# Altium schematic sheet lichten.SchDoc
size A4; SheetNumber: 1; SheetTotal: 1
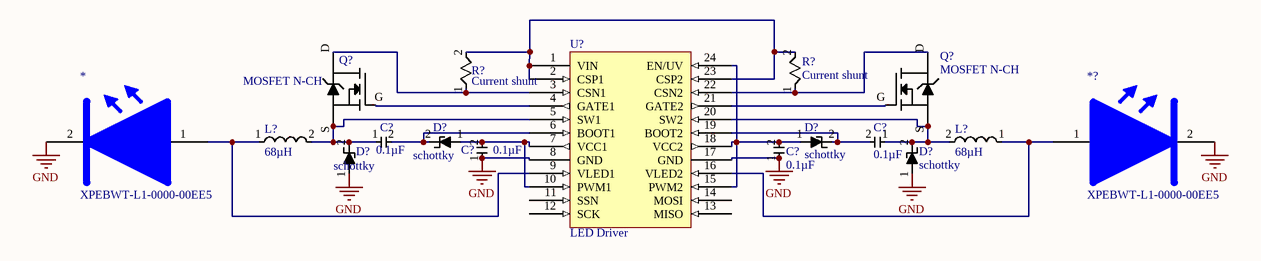
[diagram p0: lichten.SchDoc]

## Parts
(Parts that share a designator on the sheet are numbered #1, #2 ... from top to bottom, then left to right.)
*  XPEBWT-L1-0000-00EE5
*?  XPEBWT-L1-0000-00EE5
C?#1  0.1µF
C?#2  0.1µF
C?#3  0.1µF
C?#4  0.1µF
D?#1  schottky
D?#2  schottky
D?#3  schottky
D?#4  schottky
L?#1  68µH
L?#2  68µH
Q?#1  MOSFET N-CH
Q?#2  MOSFET N-CH
R?#1  Current shunt
R?#2  Current shunt
U?  LED Driver

## Nets
GND: *.2 *?.2 C?#2.1 C?#3.1 D?#3.1 D?#4.1 U?.8(GND) U?.17(GND)
Net*?_1: *?.1 L?#2.1 U?.16(VLED2)
Net*_1: *.1 L?#1.1 U?.9(VLED1)
NetC?#1_1: C?#1.1 D?#3.2 L?#1.2 Q?#1.S U?.5(SW1)
NetC?#1_2: C?#1.2 D?#1.2 U?.6(BOOT1)
NetC?#2_2: C?#2.2 D?#1.1 U?.7(VCC1) U?.10(PWM1)
NetC?#3_2: C?#3.2 D?#2.1 U?.15(PWM2) U?.18(VCC2) U?.24(EN/UV)
NetC?#4_1: C?#4.1 D?#4.2 L?#2.2 Q?#2.S U?.20(SW2)
NetC?#4_2: C?#4.2 D?#2.2 U?.19(BOOT2)
NetQ?#1_D: Q?#1.D R?#1.1 U?.3(CSN1)
NetQ?#1_G: Q?#1.G U?.4(GATE1)
NetQ?#2_D: Q?#2.D R?#2.1 U?.22(CSN2)
NetQ?#2_G: Q?#2.G U?.21(GATE2)
NetR?#1_2: R?#1.2 R?#2.2 U?.1(VIN) U?.2(CSP1) U?.23(CSP2)

Not connected (* = marked no-connect by the designer): U? 11(SSN) 12(SCK) 13(MISO) 14(MOSI)

## Library data of the parts
* *? = XPEBWT-L1-0000-00EE5: LED, XLAMP, XP-E, NEUTRAL WHITE, 114LM; Manufacturer: Cree; Lens Color: Clear; Viewing Angle: 110°; Forward Current: 350mA; Forward Voltage: 2.9V; Correlated Color Temperature (CCT): 4000K; Max Current Rating: 1A; Thermal Resistance of Package: 9°C/W; Color Rendering Index (CRI): 75; Lens Style: Square; Number of Elements: 1; Max Power Dissipation: 3W; Supplier 1: Farnell; Manufacturer Part Number: XPEBWT-L1-0000-00EE5; RoHS: Yes; Category: LEDs; Stock 1: 979; Pricing 1: 1=0,98400, 10=0,93000, 25=0,90700, 50=0,87600, 100=0,84500, 250=0,76600, 500=0,75600 (GBP); Mount: Surface Mount; Case/Package: SMD/SMT; Number of Pins: 2; Color: White; Max Operating Temperature: 85°C; Package Quantity: 1000; Packaging: Tape and Reel; Illumination Color: White; Test Current: 350mA; Luminous Flux: 114lm; Number of LEDs: 1; Series: Xlamp XP-E2; Length: 3.45mm; Width: 3.45mm; Height: 2.36mm; Depth: 3.45mm; Radiation Hardening: No; REACH SVHC: Unknown; Lead Free: Lead Free; RoHS Compliant: Yes; ComponentLink1URL: https://datasheet.ciiva.com/6348/xlampxpbl-6348581.pdf?src-supplier=Digi-Key; ComponentLink1Description: https://datasheet.ciiva.com/6348/xlampxpbl-6348581.pdf?src-supplier=Digi-Key; ComponentLink2URL: https://datasheet.ciiva.com/8073/xlampxpe-8073289.pdf?src-supplier=Element14; ComponentLink2Description: https://datasheet.ciiva.com/8073/xlampxpe-8073289.pdf?src-supplier=Element14; ComponentLink3URL: https://datasheet.ciiva.com/6348/xlampxpbl-6348587.pdf?src-supplier=Digi-Key; ComponentLink3Description: https://datasheet.ciiva.com/6348/xlampxpbl-6348587.pdf?src-supplier=Digi-Key; ComponentLink4URL: https://datasheet.ciiva.com/22791/xlampxpe-22791615.pdf?src-supplier=Farnell; ComponentLink4Description: https://datasheet.ciiva.com/22791/xlampxpe-22791615.pdf?src-supplier=Farnell; Supplier Part Number 1: 2216685
C?#1-C?#4 = C0805C104K5RACTU: Cap Ceramic 0.1uF 50V X7R 10% SMD 2.0 x 1.2 mm 125 C Paper T/R; Manufacturer: KEMET; Capacitance: 100nF; Voltage: 500V; Supplier 1: Farnell; Manufacturer Part Number: C0805C104K5RACTU; RoHS: Yes; Category: Ceramic Capacitors; Stock 1: 148517; Pricing 1: 10=0,07810, 100=0,05810, 500=0,03910, 1000=0,03450, 2000=0,03090 (GBP); Mount: Surface Mount,PCB; Case/Package: 0805; Number of Pins: 2; Case Code (Imperial): 0805; Case Code (Metric): 2012; Contact Plating: Tin,Matte; Dielectric Material: Ceramic; Min Operating Temperature: -55°C; Max Operating Temperature: 125°C; Tolerance: 10%; Dielectric: X7R; Package Quantity: 4000; Voltage Rating: 50V; Packaging: Tape and Reel; Voltage Rating (DC): 50V; Termination: SMD/SMT; Series: C0805C; Construction: Flat; Length: 2mm; Width: 1.2mm; Height: 0.9mm; Depth: 1.25mm; Lead Pitch: 0.75mm; Thickness: 0.035inch; Radiation Hardening: No; RoHS Compliant: Yes; REACH SVHC: No SVHC; ComponentLink1URL: https://datasheet.ciiva.com/14589/70095383-14589048.pdf?src-supplier=Allied+Electronics; ComponentLink1Description: https://datasheet.ciiva.com/14589/70095383-14589048.pdf?src-supplier=Allied+Electronics; ComponentLink2URL: https://datasheet.ciiva.com/28682/1851736-28682232.pdf?src-supplier=Element14; ComponentLink2Description: https://datasheet.ciiva.com/28682/1851736-28682232.pdf?src-supplier=Element14; ComponentLink3URL: https://datasheet.ciiva.com/32431/slceramic-chip-condensers-e-32431755.pdf?src-supplier=Distrelec; ComponentLink3Description: https://datasheet.ciiva.com/32431/slceramic-chip-condensers-e-32431755.pdf?src-supplier=Distrelec; ComponentLink4URL: https://datasheet.ciiva.com/18410/70095383-18410815.pdf?src-supplier=Allied+Electronics; ComponentLink4Description: https://datasheet.ciiva.com/18410/70095383-18410815.pdf?src-supplier=Allied+Electronics; Supplier Part Number 1: 1414664
D?#1-D?#4 = PMEG3050EP,115: NEXPERIA - PMEG3050EP,115 - Schottky-likriktare, 30 V, 5 A, Enkel, SOD-128, 2 Stift, 360 mV; Manufacturer: Nexperia USA; Supplier 1: Farnell; Manufacturer Part Number: PMEG3050EP,115; RoHS: No; Stock 1: 110544; Pricing 1: 5=0,38500, 10=0,33600, 100=0,21500, 500=0,14100, 1000=0,10700, 5000=0,10300 (GBP); ComponentLink1URL: http://www.farnell.com/datasheets/609324.pdf?src-supplier=Farnell; ComponentLink1Description: http://www.farnell.com/datasheets/609324.pdf?src-supplier=Farnell; ComponentLink2URL: https://assets.nexperia.com/documents/data-sheet/PMEG3050EP.pdf?src-supplier=Digi-Key; ComponentLink2Description: https://assets.nexperia.com/documents/data-sheet/PMEG3050EP.pdf?src-supplier=Digi-Key; Supplier Part Number 1: 1829197
L?#1 L?#2 = SRR1210-680M: BOURNS         SRR1210-680M.             INDUCTOR, SHIELDED, 68UH, 2.7A, SMD; Core Material: Ferrite; Tolerance: 20%; DC Resistance (DCR): 102mR; Q Factor: 12; Max DC Current: 3A; Self Resonant Frequency: 3.8MHz; Test Frequency: 100kHz; Supplier 1: Farnell; Manufacturer: Bourns; Manufacturer Part Number: SRR1210-680M; RoHS: Yes; Category: Fixed Inductors; Stock 1: 3; Pricing 1: 1=0,82800, 10=0,75600, 25=0,68400, 50=0,57100, 100=0,53600, 250=0,46600, 1250=0,43300 (GBP); Mount: Surface Mount; Case/Package: 1210; Min Operating Temperature: -40°C; Max Operating Temperature: 125°C; Inductance: 68uH; Packaging: Tape and Reel; Shielding: Shielded; Saturation Current: 2.7A; Package Quantity: 250; Current Rating: 3A; Resistor Type: Wirewound; Termination: SMD/SMT; DC Current: 3A; Series: SRR1210; Inductance Tolerance: 20%; RMS Current (Irms): 3A; Length: 12mm; Width: 0.472inch; Height: 10mm; Height - Seated (Max): 0.394inch; Depth: 12.5mm; Military Standard: Not; RoHS Compliant: Yes; REACH SVHC: No SVHC; ComponentLink1URL: https://datasheet.ciiva.com/11799/0900766b80f2b72a-11799858.pdf?src-supplier=RSComponents; ComponentLink1Description: https://datasheet.ciiva.com/11799/0900766b80f2b72a-11799858.pdf?src-supplier=RSComponents; ComponentLink2URL: https://datasheet.ciiva.com/48684/srr1210-48684857.pdf?src-supplier=Avnet; ComponentLink2Description: https://datasheet.ciiva.com/48684/srr1210-48684857.pdf?src-supplier=Avnet; ComponentLink3URL: https://datasheet.ciiva.com/17285/srr1210-17285962.pdf?src-supplier=Avnet+Europe; ComponentLink3Description: https://datasheet.ciiva.com/17285/srr1210-17285962.pdf?src-supplier=Avnet+Europe; ComponentLink4URL: https://datasheet.ciiva.com/6697/srr1210-6697611.pdf?src-supplier=Digi-Key; ComponentLink4Description: https://datasheet.ciiva.com/6697/srr1210-6697611.pdf?src-supplier=Digi-Key; ComponentLink5URL: https://datasheet.ciiva.com/46437/1430851-46437356.pdf?src-supplier=Element14; ComponentLink5Description: https://datasheet.ciiva.com/46437/1430851-46437356.pdf?src-supplier=Element14; ComponentLink6URL: https://datasheet.ciiva.com/6697/srr1210-6697613.pdf?src-supplier=Digi-Key; ComponentLink6Description: https://datasheet.ciiva.com/6697/srr1210-6697613.pdf?src-supplier=Digi-Key; ComponentLink7URL: https://datasheet.ciiva.com/46437/1430851-46437357.pdf?src-supplier=Element14; ComponentLink7Description: https://datasheet.ciiva.com/46437/1430851-46437357.pdf?src-supplier=Element14; ComponentLink8URL: https://datasheet.ciiva.com/6697/srr1210-6697615.pdf?src-supplier=Digi-Key; ComponentLink8Description: https://datasheet.ciiva.com/6697/srr1210-6697615.pdf?src-supplier=Digi-Key; Supplier Part Number 1: 2434810
Q?#1 Q?#2 = IRLR024NTRPBF: Trans MOSFET N-CH 55V 17A 3-Pin(2+Tab) DPAK T/R; Manufacturer: International Rectifier; Rise Time: 74ns; Gate to Source Voltage (Vgs): 16V; Fall Time: 29ns; Power Dissipation: 45W; Drain to Source Resistance: 110mR; Turn-Off Delay Time: 20ns; Turn-On Delay Time: 7.1ns; Rds On Max: 65mR; Input Capacitance: 480pF; Number of Elements: 1; Element Configuration: Single; Nominal Vgs: 2V; On-State Resistance: 80mR; Supplier 1: Farnell; Manufacturer Part Number: IRLR024NTRPBF; RoHS: Yes; Category: MOSFETs; Stock 1: 4226; Pricing 1: 1=0,84600, 10=0,61400, 100=0,43100, 500=0,37300, 1000=0,28400 (GBP); Mount: Surface Mount; Case/Package: DPAK; Number of Pins: 3; Min Operating Temperature: -55°C; Max Operating Temperature: 175°C; Continuous Drain Current (ID): 17A; Drain to Source Breakdown Voltage: 55V; Package Quantity: 1; Packaging: Tape and Reel; Max Power Dissipation: 45W; Drain to Source Voltage (Vdss): 55V; Voltage Rating (DC): 55V; Current Rating: 17A; Series: HEXFET®; Drain-source On Resistance-Max: 80mR; Length: 6.73mm; Width: 6.22mm; Height: 2.39mm; Radiation Hardening: No; RoHS Compliant: Yes; Lead Free: Lead Free; REACH SVHC: No SVHC; ComponentLink1URL: https://datasheet.ciiva.com/34303/2029683-34303947.pdf?src-supplier=Jameco; ComponentLink1Description: https://datasheet.ciiva.com/34303/2029683-34303947.pdf?src-supplier=Jameco; ComponentLink2URL: https://datasheet.ciiva.com/7835/irlr024npbf-7835786.pdf?src-supplier=Element14; ComponentLink2Description: https://datasheet.ciiva.com/7835/irlr024npbf-7835786.pdf?src-supplier=Element14; ComponentLink3URL: https://datasheet.ciiva.com/937/irlr024npbf-937362.pdf?src-supplier=Digi-Key; ComponentLink3Description: https://datasheet.ciiva.com/937/irlr024npbf-937362.pdf?src-supplier=Digi-Key; ComponentLink4URL: https://datasheet.ciiva.com/937/irlr024npbf-937363.pdf?src-supplier=Digi-Key; ComponentLink4Description: https://datasheet.ciiva.com/937/irlr024npbf-937363.pdf?src-supplier=Digi-Key; ComponentLink5URL: https://datasheet.ciiva.com/937/irlr024npbf-937361.pdf?src-supplier=Digi-Key; ComponentLink5Description: https://datasheet.ciiva.com/937/irlr024npbf-937361.pdf?src-supplier=Digi-Key; ComponentLink6URL: https://datasheet.ciiva.com/16364/irlr024npbf-16364248.pdf?src-supplier=Future+Electronics; ComponentLink6Description: https://datasheet.ciiva.com/16364/irlr024npbf-16364248.pdf?src-supplier=Future+Electronics; Supplier Part Number 1: 2468052
R?#1 R?#2 = ERJ-1TRQFR22U: Res Thick Film 2512 0.22 Ohm 1% 1W 200ppm/C Molded SMD SMD Embossed Carrier T/R; Manufacturer: Panasonic; Resistance: 220mR; Temperature Coefficient: 200ppm/°C; Supplier 1: Farnell; Manufacturer Part Number: ERJ-1TRQFR22U; RoHS: Yes; Category: Chip SMD Resistors; Stock 1: 2340; Pricing 1: 10=0,33700, 100=0,23200, 500=0,18800, 1000=0,15200, 2000=0,14200, 4000=0,13200, 20000=0,13100 (GBP); Mount: Surface Mount; Case/Package: 2512; Number of Pins: 2; Contact Plating: Tin; Case Code (Imperial): 2512; Case Code (Metric): 6432; Weight: 0.001429oz; Size Code: 2512; Min Operating Temperature: -55°C; Max Operating Temperature: 125°C; Power Rating: 1W; Tolerance: 1%; Resistor Type: Thick Film,Low-Ohm-Resistor; Packaging: Tape and Reel; Package Quantity: 1; Termination: SMD/SMT; Number of Terminations: 2; Max Power Dissipation: 1W; Features: Automotive AEC-Q200; Technology: THICK FILM; Series: ERJ; Resistance Tolerance: 1%; Construction: Rectangular; Length: 6.4mm; Width: 3.2mm; Height: 0.6mm; Depth: 3.2mm; Radiation Hardening: No; REACH SVHC: No SVHC; Military Standard: Not; RoHS Compliant: Yes; ComponentLink1URL: https://datasheet.ciiva.com/11810/0900766b80eefa12-11810196.pdf?src-supplier=RSComponents; ComponentLink1Description: https://datasheet.ciiva.com/11810/0900766b80eefa12-11810196.pdf?src-supplier=RSComponents; ComponentLink2URL: https://datasheet.ciiva.com/48537/erj-eng-tds-48537781.pdf?src-supplier=Distrelec; ComponentLink2Description: https://datasheet.ciiva.com/48537/erj-eng-tds-48537781.pdf?src-supplier=Distrelec; ComponentLink3URL: https://datasheet.ciiva.com/30080/6aoa0000ce3-30080535.pdf?src-supplier=Onlinecomponents.com; ComponentLink3Description: https://datasheet.ciiva.com/30080/6aoa0000ce3-30080535.pdf?src-supplier=Onlinecomponents.com; ComponentLink4URL: https://datasheet.ciiva.com/17206/aoa0000ce3-17206874.pdf?src-supplier=Avnet+Europe; ComponentLink4Description: https://datasheet.ciiva.com/17206/aoa0000ce3-17206874.pdf?src-supplier=Avnet+Europe; ComponentLink5URL: https://datasheet.ciiva.com/43455/391509-43455978.pdf?src-supplier=Farnell; ComponentLink5Description: https://datasheet.ciiva.com/43455/391509-43455978.pdf?src-supplier=Farnell; ComponentLink6URL: https://datasheet.ciiva.com/24165/aoa0000ce3-72189-24165531.pdf?src-supplier=Mouser; ComponentLink6Description: https://datasheet.ciiva.com/24165/aoa0000ce3-72189-24165531.pdf?src-supplier=Mouser; ComponentLink7URL: https://datasheet.ciiva.com/16760/70068852-16760588.pdf?src-supplier=Allied+Electronics; ComponentLink7Description: https://datasheet.ciiva.com/16760/70068852-16760588.pdf?src-supplier=Allied+Electronics; ComponentLink8URL: https://datasheet.ciiva.com/6064/391509-6064542.pdf?src-supplier=Farnell; ComponentLink8Description: https://datasheet.ciiva.com/6064/391509-6064542.pdf?src-supplier=Farnell; ComponentLink9URL: https://datasheet.ciiva.com/9118/aoa0000ce3-9118718.pdf?src-supplier=Avnet; ComponentLink9Description: https://datasheet.ciiva.com/9118/aoa0000ce3-9118718.pdf?src-supplier=Avnet; ComponentLink10URL: https://datasheet.ciiva.com/16759/70068852-16759694.pdf?src-supplier=Allied+Electronics; ComponentLink10Description: https://datasheet.ciiva.com/16759/70068852-16759694.pdf?src-supplier=Allied+Electronics; ComponentLink11URL: https://datasheet.ciiva.com/16516/aoa0000ce3-16516271.pdf?src-supplier=Avnet+Asia; ComponentLink11Description: https://datasheet.ciiva.com/16516/aoa0000ce3-16516271.pdf?src-supplier=Avnet+Asia; Supplier Part Number 1: 1717950
U? = TPS92518PWPT: 42-V Dual buck LED controller with SPI interface, analog and PWM dimming 24-HTSSOP -40 to 125; Manufacturer: Texas Instruments; Supplier 1: Farnell; Manufacturer Part Number: TPS92518PWPT; RoHS: Yes; Category: LED Drivers; Stock 1: 60; Pricing 1: 1=2,12000, 10=1,81000, 25=1,69000, 50=1,56000, 100=1,44000 (GBP); Min Operating Temperature: -40°C; Max Operating Temperature: 125°C; RoHS Compliant: Yes; Supplier Part Number 1: 2837370